# Altium schematic sheet sonar.SchDoc
size Letter; SheetNumber: 5; SheetTotal: 8
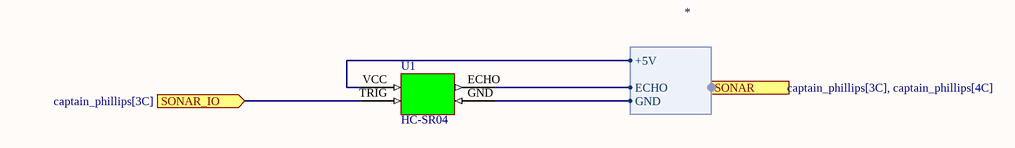
[diagram p0: sonar.SchDoc]

## Parts
U1  HC-SR04  [HC-SR04-Footprint-1]

## Ports
SONAR (harness *, see captain_phillips[3C], captain_phillips[4C]), SONAR_IO (in, see captain_phillips[3C])

## Harnesses
*: +5V, ECHO, GND

## Nets
SONAR_IO: U1.TRIG ; port SONAR_IO
NetU1_ECHO: U1.ECHO ; port SONAR.ECHO
NetU1_GND: U1.GND ; port SONAR.GND
NetU1_VCC: U1.VCC ; port SONAR.+5V

## Library data of the parts
U1 = CMP-010-00027-1: Ultrasonic Sensor, 40KHZ, 4.5M Rohs Compliant: No